# Altium project Arduino Nano.PrjPcb
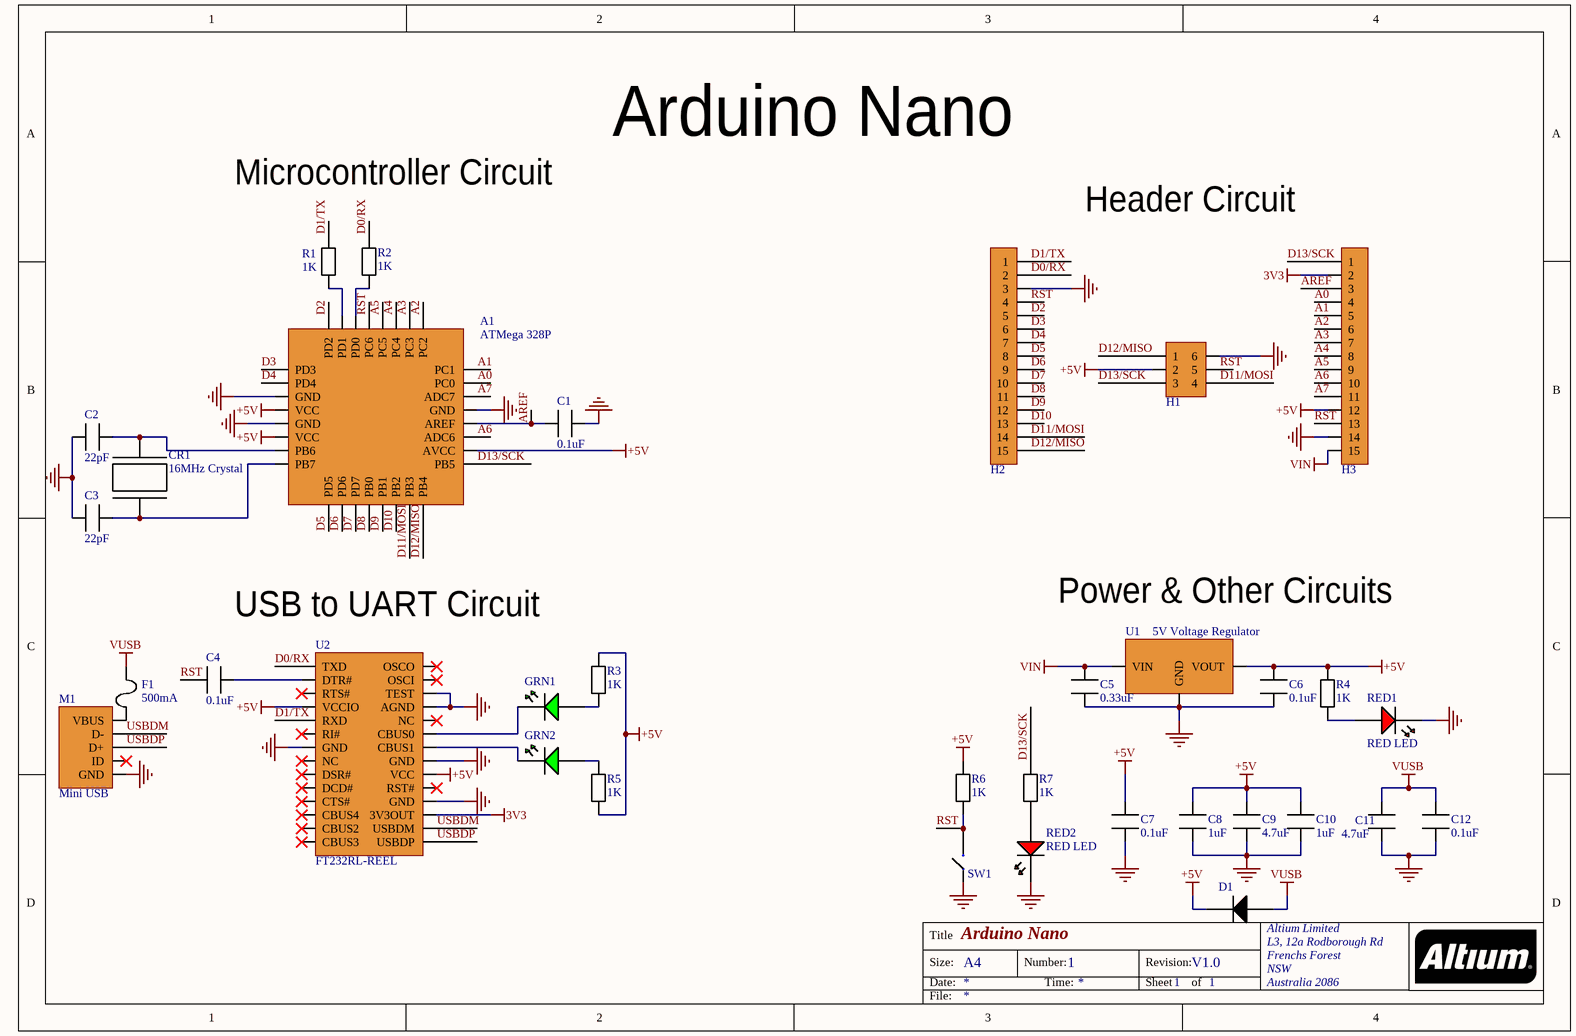
[diagram p0: Schematic.SchDoc]
1 sheet, 34 parts. Net scope: global (net labels, ports and power ports of the same name join across sheets).
Board file: PCB.PcbDoc

## Sheet Schematic.SchDoc: Arduino Nano
size A4; Organization: Altium Limited; Address1: L3, 12a Rodborough Rd; Address2: Frenchs Forest; Address3: NSW; Address4: Australia 2086; DocumentNumber: 1; Revision: V1.0; SheetNumber: 1; SheetTotal: 1

### Parts
A1  ATMega 328P  [ATmega 328P]
C1  0.1uF  [0.1uF Capacitor]
C2  22pF  [22pF]
C3  22pF  [22pF]
C4  0.1uF  [0.1uF Capacitor]
C5  0.33uF  [0.33uF Capacitor]
C6  0.1uF  [0.1uF Capacitor]
C7  0.1uF  [0.1uF Capacitor]
C8  1uF  [1uF Capacitor]
C9  4.7uF  [4.7uF Capacitor]
C10  1uF  [1uF Capacitor]
C11  4.7uF  [4.7uF Capacitor]
C12  0.1uF  [0.1uF Capacitor]
CR1  16MHz Crystal  [16MHz Crystal]
D1  Diode  [Diode]  (value not drawn)
F1  500mA  [Fuse]
GRN1  GREEN LED  [GREEN LED]  (value not drawn)
GRN2  GREEN LED  [GREEN LED]  (value not drawn)
H1  3x3  [3x3 Header]  (value not drawn)
H2  15x1  [15x1 Header]  (value not drawn)
H3  15x1  [15x1 Header]  (value not drawn)
M1  Mini USB  [Mini USB]
R1  1K  [1K Resistor]
R2  1K  [1K Resistor]
R3  1K  [1K Resistor]
R4  1K  [1K Resistor]
R5  1K  [1K Resistor]
R6  1K  [1K Resistor]
R7  1K  [1K Resistor]
RED1  RED LED  [RED LED]
RED2  RED LED  [RED LED]
SW1  Push Button  [Push Button]  (value not drawn)
U1  5V Voltage Regulator  [Voltage Regulator]
U2  FT232RL-REEL  [FTDI]

### Nets
3V3: H3.2 U2.17(3V3OUT)
+5V: A1.4(VCC) A1.6(VCC) A1.18(AVCC) C6.2 C7.1 C8.2 C9.2 C10.2 D1.1 H1.2 H3.12 R3.2 R4.2 R5.1 R6.2 U1.3(VOUT) U2.4(VCCIO) U2.20(VCC)
GND: A1.3(GND) A1.5(GND) A1.21(GND) C1.2 C2.1 C3.2 C5.1 C6.1 C7.2 C8.1 C9.1 C10.1 C11.1 C12.1 H1.6 H2.3 H3.14 M1.5(GND) RED1.1 RED2.1 SW1.1 U1.2(GND) U2.7(GND) U2.18(GND) U2.21(GND) U2.25(AGND) U2.26(TEST)
VIN: C5.2 H3.15 U1.1(VIN)
VUSB: C11.2 C12.2 D1.2 F1.2
A0: A1.23(PC0) H3.4
A1: A1.24(PC1) H3.5
A2: A1.25(PC2) H3.6
A3: A1.26(PC3) H3.7
A4: A1.27(PC4) H3.8
A5: A1.28(PC5) H3.9
A6: A1.19(ADC6) H3.10
A7: A1.22(ADC7) H3.11
AREF: A1.20(AREF) C1.1 H3.3
D0/RX: H2.2 R2.1 U2.1(TXD)
D1/TX: H2.1 R1.2 U2.5(RXD)
D2: A1.32(PD2) H2.5
D3: A1.1(PD3) H2.6
D4: A1.2(PD4) H2.7
D5: A1.9(PD5) H2.8
D6: A1.10(PD6) H2.9
D7: A1.11(PD7) H2.10
D8: A1.12(PB0) H2.11
D9: A1.13(PB1) H2.12
D10: A1.14(PB2) H2.13
D11/MOSI: A1.15(PB3) H1.4 H2.14
D12/MISO: A1.16(PB4) H1.1 H2.15
D13/SCK: A1.17(PB5) H1.3 H3.1 R7.2
RST: A1.29(PC6) C4.1 H1.5 H2.4 H3.13 R6.1 SW1.2
USBDM: M1.2(D-) U2.16(USBDM)
USBDP: M1.3(D+) U2.15(USBDP)
NetA1_7: A1.7(PB6) C2.2 CR1.1
NetA1_8: A1.8(PB7) C3.1 CR1.2
NetA1_30: A1.30(PD0) R2.2
NetA1_31: A1.31(PD1) R1.1
NetC4_2: C4.2 U2.2(DTR#)
NetF1_1: F1.1 M1.1(VBUS)
NetGRN1_1: GRN1.1 U2.23(CBUS0)
NetGRN1_2: GRN1.2 R3.1
NetGRN2_1: GRN2.1 U2.22(CBUS1)
NetGRN2_2: GRN2.2 R5.2
NetR4_1: R4.1 RED1.2
NetR7_1: R7.1 RED2.2

Not connected (* = marked no-connect by the designer): M1 4(ID)*; U2 3(RTS#)* 6(RI#)* 8(NC)* 9(DSR#)* 10(DCD#)* 11(CTS#)* 12(CBUS4)* 13(CBUS2)* 14(CBUS3)* 19(RST#)* 24(NC)* 27(OSCI)* 28(OSCO)*

### Notes on the sheet
- Microcontroller Circuit
- (near H3) Header Circuit
- USB to UART Circuit
- Power & Other Circuits
- Title
- Size:
- Date:
- A4
- Number:
- Time:
- Revision:
- Sheet
- of
- File:

### Library data of the parts
A1 = ATMEGA328P-AUR: ATMEL         ATMEGA328P-AUR             8 Bit Microcontroller, Low Power High Performance, ATmega, 20 MHz, 32 KB, 2 KB, 32 Pins, TQFP; Manufacturer: Microchip / Atmel; Min Supply Voltage: 1.8V; Max Supply Voltage: 5.5V; Frequency: 20MHz; Interface: I2C,SPI,UART,USART; RAM Size: 2KB; Number of I/Os: 23; Number of Timers/Counters: 3; Oscillator Type: Internal; Data Bus Width: 8b; Watchdog Timer: Yes; Memory Type: FLASH; Memory Size: 32KB; Peripherals: Brown-out Detect/Reset,POR,PWM,WDT; Core Architecture: AVR; Supplier 1: Digi-Key; Manufacturer Part Number: ATMEGA328P-AUR; RoHS: Yes; Category: Microcontrollers; Stock 1: 15541; Pricing 1: 1=2.08000, 25=1.91000, 100=1.73000 (USD); Mount: Surface Mount; Case/Package: A; Number of Pins: 32; Contact Plating: Tin,Matte; Min Operating Temperature: -40°C; Max Operating Temperature: 85°C; Packaging: Tape and Reel; Package Quantity: 2000; Number of Programmable I/O: 23; Max Frequency: 20MHz; REACH SVHC: No SVHC; Lead Free: Lead Free; ComponentLink1URL: https://datasheet.ciiva.com/6641/atmega48a-pa-88a-pa-168a-pa-328-p-ds-ds40002061a-6641009.pdf?src-supplier=Digi-Key; ComponentLink1Description: https://datasheet.ciiva.com/6641/atmega48a-pa-88a-pa-168a-pa-328-p-ds-ds40002061a-6641009.pdf?src-supplier=Digi-Key; Supplier Part Number 1: ATMEGA328P-AURCT-ND
C1 C4 C6 C7 C12 = EMK105BJ104KV-F: TAIYO YUDEN - EMK105BJ104KV-F - CERAMIC CAPACITOR, 0.1UF, 16V, X5R, 10%, 0402, FULL REEL; Capacitance: 100nF; Supplier 1: Digi-Key; Manufacturer: Taiyo Yuden; Manufacturer Part Number: EMK105BJ104KV-F; RoHS: Yes; Category: Ceramic Capacitors; Stock 1: 2015960; Pricing 1: 1=0.10000, 10=0.02100, 50=0.01120, 100=0.00920, 500=0.00654, 1000=0.00514, 2500=0.00468, 5000=0.00430 (USD); Mount: Surface Mount; Case/Package: 0402; Number of Pins: 2; Contact Plating: Tin; Case Code (Metric): 1005; Case Code (Imperial): 0402; Min Operating Temperature: -55°C; Max Operating Temperature: 85°C; Dielectric: X5R; Tolerance: 10%; Packaging: Tape and Reel; Voltage Rating (DC): 16V; Termination: SMD/SMT; Resistor Type: Ceramic; Voltage Rating: 16V; Package Quantity: 1; Length: 1mm; Width: 0.02inch; Height: 0.5mm; Thickness: 0.022inch; Depth: 0.5mm; Radiation Hardening: No; Lead Free: Lead Free; Halogen Free: Halogen Free; REACH SVHC: Unknown; ComponentLink1URL: https://datasheet.ciiva.com/30156/744emk105bj104kv-f-30156673.pdf?src-supplier=Onlinecomponents.com; ComponentLink1Description: https://datasheet.ciiva.com/30156/744emk105bj104kv-f-30156673.pdf?src-supplier=Onlinecomponents.com; ComponentLink2URL: https://datasheet.ciiva.com/30119/255emk105bj104kv-f-30119734.pdf?src-supplier=Onlinecomponents.com; ComponentLink2Description: https://datasheet.ciiva.com/30119/255emk105bj104kv-f-30119734.pdf?src-supplier=Onlinecomponents.com; ComponentLink3URL: https://datasheet.ciiva.com/129/emk105bj104kv-f-ss-129786.pdf?src-supplier=Digi-Key; ComponentLink3Description: https://datasheet.ciiva.com/129/emk105bj104kv-f-ss-129786.pdf?src-supplier=Digi-Key; ComponentLink4URL: https://datasheet.ciiva.com/15920/1135emk105bj104kv-f-15920444.pdf?src-supplier=Onlinecomponents.com; ComponentLink4Description: https://datasheet.ciiva.com/15920/1135emk105bj104kv-f-15920444.pdf?src-supplier=Onlinecomponents.com; ComponentLink5URL: https://datasheet.ciiva.com/5443/mlcc-all-e-541559-5443819.pdf?src-supplier=Mouser; ComponentLink5Description: https://datasheet.ciiva.com/5443/mlcc-all-e-541559-5443819.pdf?src-supplier=Mouser; Supplier Part Number 1: 587-1226-1-ND
C2 C3 = 04025A220FAT2A: Cap Ceramic 22pF 50V C0G 1% SMD 0402 125C Paper T/R; Manufacturer: Kyocera AVX; Supplier 1: Digi-Key; Manufacturer Part Number: 04025A220FAT2A; RoHS: Yes; Category: Ceramic Capacitors; Stock 1: 43003; Pricing 1: 1=0.51000, 10=0.36100, 50=0.27280, 100=0.23760, 500=0.17600, 1000=0.14960, 2500=0.14080, 5000=0.13200 (USD); Mount: Surface Mount; Case/Package: 0402; Case Code (Metric): 1005; Case Code (Imperial): 0402; Contact Plating: Tin,Matte; Min Operating Temperature: -55°C; Max Operating Temperature: 125°C; Capacitance: 22pF; Tolerance: 1%; Voltage Rating: 50V; Packaging: Tape and Reel; Package Quantity: 1; Voltage Rating (DC): 50V; Dielectric: C0G; Termination: SMD/SMT; Length: 1mm; Width: 0.02inch; Height: 0.56mm; Thickness: 0.022inch; Depth: 0.5mm; Radiation Hardening: No; REACH SVHC: Unknown; Lead Free: Lead Free; ComponentLink1URL: https://datasheet.ciiva.com/153/ccog-153298.pdf?src-supplier=Digi-Key; ComponentLink1Description: https://datasheet.ciiva.com/153/ccog-153298.pdf?src-supplier=Digi-Key; ComponentLink2URL: https://datasheet.ciiva.com/153/ccog-153299.pdf?src-supplier=Digi-Key; ComponentLink2Description: https://datasheet.ciiva.com/153/ccog-153299.pdf?src-supplier=Digi-Key; ComponentLink3URL: https://datasheet.ciiva.com/153/ccog-153300.pdf?src-supplier=Digi-Key; ComponentLink3Description: https://datasheet.ciiva.com/153/ccog-153300.pdf?src-supplier=Digi-Key; ComponentLink4URL: https://datasheet.ciiva.com/11530/ccog-11530021.pdf?src-supplier=Avnet; ComponentLink4Description: https://datasheet.ciiva.com/11530/ccog-11530021.pdf?src-supplier=Avnet; ComponentLink5URL: https://datasheet.ciiva.com/5419/ccog-243403-5419529.pdf?src-supplier=Mouser; ComponentLink5Description: https://datasheet.ciiva.com/5419/ccog-243403-5419529.pdf?src-supplier=Mouser; Supplier Part Number 1: 478-5765-1-ND
C5 = CGA2B1X7S1C334K050BC: Automotive Grade; Manufacturer: TDK; Capacitance: 330nF; Voltage Rating: 16V; Tolerance: 10%; Dielectric: X7S; Supplier 1: Digi-Key; Manufacturer Part Number: CGA2B1X7S1C334K050BC; RoHS: Yes; Category: Ceramic Capacitors; Stock 1: 26015; Pricing 1: 1=0.23000, 10=0.15800, 50=0.09460, 100=0.07980, 500=0.05460, 1000=0.04830, 2500=0.04620, 5000=0.04200 (USD); Mount: Surface Mount; Case/Package: 0402; Case Code (Imperial): 0402; Case Code (Metric): 1005; Weight: 2.3E-05oz; Min Operating Temperature: -55°C; Max Operating Temperature: 125°C; Packaging: Tape and Reel; Termination: SMD/SMT; Voltage Rating (DC): 16V; Package Quantity: 10000; Length: 0.039inch; Width: 0.02inch; Height: 0.5mm; Thickness: 0.022inch; Ratings: AEC-Q200; ComponentLink1URL: https://product.tdk.com/info/en/catalog/datasheets/mlcc_automotive_general_en.pdf?src-supplier=Digi-Key; ComponentLink1Description: https://product.tdk.com/info/en/catalog/datasheets/mlcc_automotive_general_en.pdf?src-supplier=Digi-Key; ComponentLink2URL: https://product.tdk.com/info/en/catalog/spec/mlccspec_automotive_general_midvoltage_en.pdf?src-supplier=Digi-Key; ComponentLink2Description: https://product.tdk.com/info/en/catalog/spec/mlccspec_automotive_general_midvoltage_en.pdf?src-supplier=Digi-Key; ComponentLink3URL: http://product.tdk.com/capacitor/mlcc/class/print_detail_pdf.php?lang=en&part_no=CGA2B1X7S1C334K050BC&src-supplier=Avnet; ComponentLink3Description: http://product.tdk.com/capacitor/mlcc/class/print_detail_pdf.php?lang=en&part_no=CGA2B1X7S1C334K050BC&src-supplier=Avnet; ComponentLink4URL: http://product.tdk.com/capacitor/mlcc/detailed_information.php?lang=en&ref=jp&part_no=CGA2B1X7S1C334K050BC&src-supplier=Mouser; ComponentLink4Description: http://product.tdk.com/capacitor/mlcc/detailed_information.php?lang=en&ref=jp&part_no=CGA2B1X7S1C334K050BC&src-supplier=Mouser; Supplier Part Number 1: 445-180203-1-ND
C8 C10 = LMK105BJ105KV-F: Manufacturer: Taiyo Yuden; Tolerance: 10%; Voltage Rating (DC): 10V; Dielectric: X5R; Supplier 1: Digi-Key; Manufacturer Part Number: LMK105BJ105KV-F; RoHS: Yes; Category: Ceramic Capacitors; Stock 1: 3118229; Pricing 1: 1=0.11000, 10=0.07900, 50=0.04300, 100=0.03500, 500=0.02502, 1000=0.01966, 2500=0.01788, 5000=0.01645 (USD); Mount: Surface Mount; Case/Package: 0402; Case Code (Imperial): 0402; Case Code (Metric): 1005; Min Operating Temperature: -55°C; Max Operating Temperature: 85°C; Capacitance: 1uF; Packaging: Tape and Reel; Package Quantity: 1; Voltage Rating: 10V; Termination: SMD/SMT; Resistor Type: Ceramic; Length: 1mm; Width: 0.5mm; Height: 0.5mm; Thickness: 0.022inch; Depth: 0.5mm; Radiation Hardening: No; Lead Free: Lead Free; Halogen Free: Halogen Free; REACH SVHC: Unknown; ComponentLink1URL: https://datasheet.ciiva.com/26872/getdatasheetpartid-637441-26872608.pdf?src-supplier=Verical; ComponentLink1Description: https://datasheet.ciiva.com/26872/getdatasheetpartid-637441-26872608.pdf?src-supplier=Verical; ComponentLink2URL: https://datasheet.ciiva.com/15921/463lmk105bj105kv-f-15921218.pdf?src-supplier=Onlinecomponents.com; ComponentLink2Description: https://datasheet.ciiva.com/15921/463lmk105bj105kv-f-15921218.pdf?src-supplier=Onlinecomponents.com; ComponentLink3URL: https://datasheet.ciiva.com/131/lmk105bj105kv-f-ss-131735.pdf?src-supplier=Digi-Key; ComponentLink3Description: https://datasheet.ciiva.com/131/lmk105bj105kv-f-ss-131735.pdf?src-supplier=Digi-Key; ComponentLink4URL: https://datasheet.ciiva.com/30256/308lmk105bj105kv-f-30256903.pdf?src-supplier=Onlinecomponents.com; ComponentLink4Description: https://datasheet.ciiva.com/30256/308lmk105bj105kv-f-30256903.pdf?src-supplier=Onlinecomponents.com; Supplier Part Number 1: 587-1454-1-ND
C9 C11 = JMK105BBJ475MVHF: CAP CER 4.7UF 6.3V X5R 0402; Manufacturer: Taiyo Yuden; Tolerance: 20%; Supplier 1: Digi-Key; Manufacturer Part Number: JMK105BBJ475MVHF; RoHS: Yes; Category: Ceramic Capacitors; Stock 1: 77436; Pricing 1: 1=0.18000, 10=0.12700, 50=0.07220, 100=0.05980, 500=0.04194, 1000=0.03472, 2500=0.03231, 5000=0.02956 (USD); Mount: Surface Mount; Case/Package: 0402; Weight: 2.3E-05oz; Case Code (Metric): 1005; Contact Plating: Tin; Case Code (Imperial): 0402; Min Operating Temperature: -55°C; Max Operating Temperature: 85°C; Dielectric: X5R; Termination: SMD/SMT; Voltage Rating (DC): 6.3V; Packaging: Tape and Reel; Voltage Rating: 6.3V; Capacitance: 4.7uF; Package Quantity: 10000; Length: 1mm; Width: 0.5mm; Height: 0.5mm; Thickness: 0.026inch; Ratings: AEC-Q200; Lead Free: Lead Free; Halogen Free: Halogen Free; ComponentLink1URL: http://www.farnell.com/datasheets/2819875.pdf?src-supplier=Farnell; ComponentLink1Description: http://www.farnell.com/datasheets/2819875.pdf?src-supplier=Farnell; ComponentLink2URL: http://www.mouser.com/ds/2/396/mlcc11_hq_e-541564.pdf?src-supplier=Mouser; ComponentLink2Description: http://www.mouser.com/ds/2/396/mlcc11_hq_e-541564.pdf?src-supplier=Mouser; ComponentLink3URL: http://www.yuden.co.jp/ut/product/category/capacitor/putpdf/JMK105BBJ475MVHF_SS.pdf?src-supplier=Avnet; ComponentLink3Description: http://www.yuden.co.jp/ut/product/category/capacitor/putpdf/JMK105BBJ475MVHF_SS.pdf?src-supplier=Avnet; ComponentLink4URL: http://www.farnell.com/datasheets/2819875.pdf?src-supplier=Newark; ComponentLink4Description: http://www.farnell.com/datasheets/2819875.pdf?src-supplier=Newark; ComponentLink5URL: http://www.farnell.com/datasheets/2819875.pdf?src-supplier=Element14; ComponentLink5Description: http://www.farnell.com/datasheets/2819875.pdf?src-supplier=Element14; ComponentLink6URL: http://www.yuden.co.jp/productdata/catalog/en/mlcc_all_e.pdf?src-supplier=Avnet+Asia; ComponentLink6Description: http://www.yuden.co.jp/productdata/catalog/en/mlcc_all_e.pdf?src-supplier=Avnet+Asia; ComponentLink7URL: http://www.yuden.co.jp/productdata/catalog/en/mlcc_all_hq_e.pdf?src-supplier=Digi-Key; ComponentLink7Description: http://www.yuden.co.jp/productdata/catalog/en/mlcc_all_hq_e.pdf?src-supplier=Digi-Key; ComponentLink8URL: http://ds.yuden.co.jp/TYCOMPAS/ut/detail.do?productNo=JMK105BBJ475MVHF&fileName=JMK105BBJ475MVHF_SS&mode=specSheetDownload&src-supplier=Digi-Key; ComponentLink8Description: http://ds.yuden.co.jp/TYCOMPAS/ut/detail.do?productNo=JMK105BBJ475MVHF&fileName=JMK105BBJ475MVHF_SS&mode=specSheetDownload&src-supplier=Digi-Key; Supplier Part Number 1: 587-3711-1-ND
CR1 = ECS-160-20-5PX-TR: CRYSTAL 16.0000MHZ 20PF SMD; Manufacturer: ECS International; Frequency Tolerance: 30ppm; ESR (Equivalent Series Resistance): 40R; Frequency Stability: 50ppm; Supplier 1: Digi-Key; Manufacturer Part Number: ECS-160-20-5PX-TR; RoHS: Yes; Category: Crystals; Stock 1: 15488; Pricing 1: 1=0.45000, 10=0.37500, 50=0.33760, 100=0.30000, 500=0.28500 (USD); Mount: Surface Mount; Number of Pins: 2; Min Operating Temperature: -10°C; Max Operating Temperature: 70°C; Package Quantity: 1000; Frequency: 16MHz; Load Capacitance: 20pF; Packaging: Tape and Reel; Tolerance: 30ppm; Termination: SMD/SMT; Length: 0.449inch; Width: 0.189inch; Height: 0.169inch; Lead Free: Lead Free; ComponentLink1URL: https://datasheet.ciiva.com/852/csm-7x-852386.pdf?src-supplier=Digi-Key; ComponentLink1Description: https://datasheet.ciiva.com/852/csm-7x-852386.pdf?src-supplier=Digi-Key; ComponentLink2URL: https://datasheet.ciiva.com/852/csm-7x-852388.pdf?src-supplier=Digi-Key; ComponentLink2Description: https://datasheet.ciiva.com/852/csm-7x-852388.pdf?src-supplier=Digi-Key; ComponentLink3URL: https://datasheet.ciiva.com/852/csm-7x-852387.pdf?src-supplier=Digi-Key; ComponentLink3Description: https://datasheet.ciiva.com/852/csm-7x-852387.pdf?src-supplier=Digi-Key; Supplier Part Number 1: XC1282CT-ND
D1 = BAT54LP-7: MULTICOMP PRO - BAT54LP-7 - DIODE, ULTRAFAST RECOVERY, 100mA, 30V, DFN1006; Manufacturer: Diodes; Forward Voltage: 1V; Forward Current: 200mA; Max Reverse Current: 2uA; Reverse Recovery Time: 5ns; Power Dissipation: 250mW; Max Forward Surge Current (Ifsm): 600mA; Element Configuration: Single; Polarity: Standard; Capacitance: 10pF; Supplier 1: Digi-Key; Manufacturer Part Number: BAT54LP-7; RoHS: Yes; Category: Schottky Diodes; Stock 1: 105889; Pricing 1: 1=0.40000, 10=0.28200, 100=0.14250, 500=0.11626, 1000=0.08625 (USD); Mount: Surface Mount; Case/Package: DFN; Number of Pins: 2; Contact Plating: Gold; Min Operating Temperature: -65°C; Max Operating Temperature: 125°C; Packaging: Tape and Reel; Package Quantity: 3000; Average Rectified Current: 200mA; Max Repetitive Reverse Voltage (Vrrm): 30V; Peak Non-Repetitive Surge Current: 600mA; Voltage Rating (DC): 30V; Power Rating: 250mW; Current Rating: 200mA; Output Current: 200mA; Max Reverse Voltage (DC): 30V; Length: 1mm; Width: 0.6mm; Height: 0.47mm; Radiation Hardening: No; REACH SVHC: No SVHC; Lead Free: Lead Free; ComponentLink1URL: https://datasheet.ciiva.com/16210/ds30504-16210561.pdf?src-supplier=Future+Electronics; ComponentLink1Description: https://datasheet.ciiva.com/16210/ds30504-16210561.pdf?src-supplier=Future+Electronics; ComponentLink2URL: https://datasheet.ciiva.com/4715/ds30504-85267-4715512.pdf?src-supplier=Mouser; ComponentLink2Description: https://datasheet.ciiva.com/4715/ds30504-85267-4715512.pdf?src-supplier=Mouser; ComponentLink3URL: https://datasheet.ciiva.com/15144/getdatasheetpartid-39647-15144085.pdf?src-supplier=Verical; ComponentLink3Description: https://datasheet.ciiva.com/15144/getdatasheetpartid-39647-15144085.pdf?src-supplier=Verical; ComponentLink4URL: https://datasheet.ciiva.com/8303/ds30504-8303286.pdf?src-supplier=Avnet; ComponentLink4Description: https://datasheet.ciiva.com/8303/ds30504-8303286.pdf?src-supplier=Avnet; ComponentLink5URL: https://datasheet.ciiva.com/8300/ds30504-8300695.pdf?src-supplier=Avnet; ComponentLink5Description: https://datasheet.ciiva.com/8300/ds30504-8300695.pdf?src-supplier=Avnet; ComponentLink6URL: https://datasheet.ciiva.com/22695/1915672-22695255.pdf?src-supplier=Element14; ComponentLink6Description: https://datasheet.ciiva.com/22695/1915672-22695255.pdf?src-supplier=Element14; ComponentLink7URL: https://datasheet.ciiva.com/913/ds30504-913080.pdf?src-supplier=Digi-Key; ComponentLink7Description: https://datasheet.ciiva.com/913/ds30504-913080.pdf?src-supplier=Digi-Key; ComponentLink8URL: https://datasheet.ciiva.com/913/ds30504-913081.pdf?src-supplier=Digi-Key; ComponentLink8Description: https://datasheet.ciiva.com/913/ds30504-913081.pdf?src-supplier=Digi-Key; ComponentLink9URL: https://datasheet.ciiva.com/913/ds30504-913082.pdf?src-supplier=Digi-Key; ComponentLink9Description: https://datasheet.ciiva.com/913/ds30504-913082.pdf?src-supplier=Digi-Key; ComponentLink10URL: https://datasheet.ciiva.com/1180/ds30504-1180298.pdf?src-supplier=Element14; ComponentLink10Description: https://datasheet.ciiva.com/1180/ds30504-1180298.pdf?src-supplier=Element14; ComponentLink11URL: https://datasheet.ciiva.com/25947/ds30504-25947226.pdf?src-supplier=Avnet+Europe; ComponentLink11Description: https://datasheet.ciiva.com/25947/ds30504-25947226.pdf?src-supplier=Avnet+Europe; Supplier Part Number 1: BAT54LPDICT-ND
F1 = C1Q500: Fuse Chip 0.5A 125V Very Fast 2-Pin Solder Pad Surface Mount T/R; Manufacturer: Bel; Max Voltage Rating (DC): 63V; DC Cold Resistance: 320mR; Power Dissipation: 140mW; Fuse Type: Board Mount (Cartridge Style Excluded); Approvals: CSA,CE,cULus; Supplier 1: Digi-Key; Manufacturer Part Number: C1Q500; RoHS: Yes; Category: Fuses; Stock 1: 93521; Pricing 1: 1=0.28000, 5=0.27600, 10=0.26300, 50=0.23500, 100=0.21870, 250=0.19440, 500=0.16200, 1000=0.15390 (USD); Mount: Surface Mount; Case/Package: 1206; Number of Pins: 2; Case Code (Metric): 3216; Case Code (Imperial): 1206; Housing Material: Ceramic; Min Operating Temperature: -55°C; Max Operating Temperature: 125°C; Current Rating: 500mA; Voltage Rating (AC): 125V; Voltage Rating (DC): 63V; Packaging: Tape and Reel; Length: 3.07mm; Width: 0.062inch; Height: 0.023inch; Depth: 1.52mm; Lead Free: Lead Free; ComponentLink1URL: https://datasheet.ciiva.com/300/c1q-300590.pdf?src-supplier=Digi-Key; ComponentLink1Description: https://datasheet.ciiva.com/300/c1q-300590.pdf?src-supplier=Digi-Key; ComponentLink2URL: https://datasheet.ciiva.com/300/c1q-300592.pdf?src-supplier=Digi-Key; ComponentLink2Description: https://datasheet.ciiva.com/300/c1q-300592.pdf?src-supplier=Digi-Key; ComponentLink3URL: https://datasheet.ciiva.com/300/c1q-300591.pdf?src-supplier=Digi-Key; ComponentLink3Description: https://datasheet.ciiva.com/300/c1q-300591.pdf?src-supplier=Digi-Key; ComponentLink4URL: https://datasheet.ciiva.com/8264/c1q-8264015.pdf?src-supplier=Avnet; ComponentLink4Description: https://datasheet.ciiva.com/8264/c1q-8264015.pdf?src-supplier=Avnet; Supplier Part Number 1: 507-1075-1-ND
GRN1 GRN2 = 150040VS73240: LED GREEN CLEAR 0402 SMD; Manufacturer: Wurth Electronics; Lens Color: Colorless; Lens Style: Flat; Luminous Intensity: 50mcd; Forward Voltage: 2V; Test Current: 20mA; Viewing Angle: 120°; Dominant Wavelength: 570nm; Lens Size: 0.5mm; Supplier 1: Digi-Key; Manufacturer Part Number: 150040VS73240; RoHS: No; Category: LEDs; Stock 1: 46612; Pricing 1: 1=0.30000, 10=0.25400, 100=0.22900, 500=0.20400, 1000=0.17900 (USD); Mount: Surface Mount; Case/Package: 0402; Color: Green; Case Code (Imperial): 0402; Case Code (Metric): 1005; Packaging: Tape and Reel; Lens Transparency: Clear; Length: 1mm; Width: 0.5mm; Height: 0.5mm; ComponentLink1URL: http://www.farnell.com/datasheets/2621637.pdf?src-supplier=Farnell; ComponentLink1Description: http://www.farnell.com/datasheets/2621637.pdf?src-supplier=Farnell; ComponentLink2URL: https://katalog.we-online.de/pbs/datasheet/150040VS73240.pdf?src-supplier=Digi-Key; ComponentLink2Description: https://katalog.we-online.de/pbs/datasheet/150040VS73240.pdf?src-supplier=Digi-Key; ComponentLink3URL: http://www.farnell.com/datasheets/2621637.pdf?src-supplier=Element14; ComponentLink3Description: http://www.farnell.com/datasheets/2621637.pdf?src-supplier=Element14; ComponentLink4URL: http://www.farnell.com/datasheets/2621637.pdf?src-supplier=Newark; ComponentLink4Description: http://www.farnell.com/datasheets/2621637.pdf?src-supplier=Newark; Supplier Part Number 1: 732-11992-1-ND
H1 = 61300621121: CONN HEADER VERT 6POS 2.54MM; Manufacturer: Wurth Electronics; Number of Positions: 6; Gender: Male; Connector Type: Male Pin; Pitch: 0.1inch; Supplier 1: Digi-Key; Manufacturer Part Number: 61300621121; RoHS: Yes; Category: Connectors; Stock 1: 5661; Pricing 1: 1=0.54000, 10=0.45400, 25=0.37920, 50=0.31600, 100=0.28700, 1000=0.26100 (USD); Mount: Through Hole; Contact Plating: Gold; Contact Material: Copper; Color: Black; Number of Rows: 2; Packaging: Bulk; Termination: Solder; Number of Contacts: 6; Row Spacing: 0.1inch; Contact Mating Length: 0.236inch; REACH SVHC: Unknown; ComponentLink1URL: https://datasheet.ciiva.com/28505/1442180-28505463.pdf?src-supplier=Element14; ComponentLink1Description: https://datasheet.ciiva.com/28505/1442180-28505463.pdf?src-supplier=Element14; Supplier Part Number 1: 732-5295-ND
H2 H3 = 61301511121: WURTH ELEKTRONIK         61301511121            Board-To-Board Connector, Vertical, WR-PHD Series, Through Hole, Header, 15 Contacts, 2.54 mm; Manufacturer: Wurth Electronics; Number of Positions: 15; Gender: Male; Connector Type: Male Pin; Pitch: 0.1inch; Supplier 1: Digi-Key; Manufacturer Part Number: 61301511121; RoHS: Yes; Category: Connectors; Stock 1: 461; Pricing 1: 1=0.82000, 10=0.69700, 25=0.58120, 50=0.48400, 100=0.44000, 500=0.40000 (USD); Mount: Through Hole; Color: Black; Contact Plating: Gold; Contact Material: Copper; Packaging: Bulk; Termination: Solder; Number of Contacts: 15; Number of Rows: 1; Contact Mating Length: 0.236inch; REACH SVHC: Unknown; ComponentLink1URL: https://katalog.we-online.de/em/datasheet/6130xx11121.pdf?src-supplier=Digi-Key; ComponentLink1Description: https://katalog.we-online.de/em/datasheet/6130xx11121.pdf?src-supplier=Digi-Key; ComponentLink2URL: http://www.farnell.com/cad/1737268.pdf?src-supplier=Element14; ComponentLink2Description: http://www.farnell.com/cad/1737268.pdf?src-supplier=Element14; Supplier Part Number 1: 732-5326-ND
M1 = 65100516121: CONN RCPT USB2.0 MINI B SMD R/A; Manufacturer: Wurth Electronics; Gender: Receptacle; Contact Resistance: 20mR; Current Rating: 1A; Mating Cycles: 1500; Voltage Rating: 30V; Connector Type: USB,Socket; Number of Contacts: 5; Number of Ports: 1; Insulation Resistance: 1GR; Supplier 1: Digi-Key; Manufacturer Part Number: 65100516121; RoHS: Yes; Category: Connectors; Stock 1: 2378; Pricing 1: 1=1.32000, 10=1.16500, 50=1.09800, 100=0.98600, 250=0.89600 (USD); Mount: Surface Mount,Horizontal; Color: Black; Contact Plating: Gold; Contact Material: Copper Alloy; Min Operating Temperature: -40°C; Max Operating Temperature: 105°C; Package Quantity: 500; Packaging: Tape and Reel; Number of Positions: 5; Termination: Solder; Working Voltage: 30V; Orientation: Right Angle; USB Standard: USB 2.0; Length: 7.7mm; Width: 9.25mm; REACH SVHC: Unknown; Lead Free: Lead Free; Flammability Rating: UL94 V-0; ComponentLink1URL: https://datasheet.ciiva.com/29660/65100516121-29660272.pdf?src-supplier=Digi-Key; ComponentLink1Description: https://datasheet.ciiva.com/29660/65100516121-29660272.pdf?src-supplier=Digi-Key; ComponentLink2URL: https://datasheet.ciiva.com/22694/1442207-22694625.pdf?src-supplier=Element14; ComponentLink2Description: https://datasheet.ciiva.com/22694/1442207-22694625.pdf?src-supplier=Element14; ComponentLink3URL: https://datasheet.ciiva.com/4598/65100516121-83749-4598775.pdf?src-supplier=Mouser; ComponentLink3Description: https://datasheet.ciiva.com/4598/65100516121-83749-4598775.pdf?src-supplier=Mouser; ComponentLink4URL: https://datasheet.ciiva.com/851/65100516121-851772.pdf?src-supplier=Digi-Key; ComponentLink4Description: https://datasheet.ciiva.com/851/65100516121-851772.pdf?src-supplier=Digi-Key; ComponentLink5URL: https://datasheet.ciiva.com/11731/0900766b81023aba-11731279.pdf?src-supplier=RSComponents; ComponentLink5Description: https://datasheet.ciiva.com/11731/0900766b81023aba-11731279.pdf?src-supplier=RSComponents; ComponentLink6URL: https://datasheet.ciiva.com/1098/1442207-1098982.pdf?src-supplier=Element14; ComponentLink6Description: https://datasheet.ciiva.com/1098/1442207-1098982.pdf?src-supplier=Element14; ComponentLink7URL: https://datasheet.ciiva.com/22652/1442207-22652217.pdf?src-supplier=Farnell; ComponentLink7Description: https://datasheet.ciiva.com/22652/1442207-22652217.pdf?src-supplier=Farnell; ComponentLink8URL: https://datasheet.ciiva.com/14103/4257103-eng-datasheet-14103419.pdf?src-supplier=Distrelec; ComponentLink8Description: https://datasheet.ciiva.com/14103/4257103-eng-datasheet-14103419.pdf?src-supplier=Distrelec; ComponentLink9URL: https://datasheet.ciiva.com/48712/001088422-da-01-en-wr-com-mini-mini-usb-typ-b-65100516121-48712668.pdf?src-supplier=Conrad; ComponentLink9Description: https://datasheet.ciiva.com/48712/001088422-da-01-en-wr-com-mini-mini-usb-typ-b-65100516121-48712668.pdf?src-supplier=Conrad; Supplier Part Number 1: 732-2109-1-ND
R1-R7 = RMCF0402FT1K00: RES 1K OHM 1% 1/16W 0402; Manufacturer: Stackpole Electronics; Max Power Dissipation: 63mW; Temperature Coefficient: 100ppm/°C; Resistance: 1kR; Supplier 1: Digi-Key; Manufacturer Part Number: RMCF0402FT1K00; RoHS: Yes; Category: Chip SMD Resistors; Stock 1: 290118; Pricing 1: 1=0.10000, 10=0.01300, 100=0.00530, 1000=0.00239, 2500=0.00207, 5000=0.00171 (USD); Mount: Surface Mount; Case/Package: 0402; Case Code (Metric): 1005; Case Code (Imperial): 0402; Contact Plating: Tin,Matte; Min Operating Temperature: -55°C; Max Operating Temperature: 155°C; Tolerance: 1%; Features: Automotive AEC-Q200; Resistor Type: Thick Film; Number of Terminations: 2; Packaging: Tape and Reel; Power Rating: 63mW; Length: 1mm; Width: 0.02inch; Height: 0.016inch; Depth: 0.5mm; Radiation Hardening: No; Military Standard: Not; Lead Free: Lead Free; ComponentLink1URL: https://datasheet.ciiva.com/15193/getdatasheetpartid-365385-15193418.pdf?src-supplier=Verical; ComponentLink1Description: https://datasheet.ciiva.com/15193/getdatasheetpartid-365385-15193418.pdf?src-supplier=Verical; ComponentLink2URL: https://datasheet.ciiva.com/24336/sei-rmcp-24336266.pdf?src-supplier=Onlinecomponents.com; ComponentLink2Description: https://datasheet.ciiva.com/24336/sei-rmcp-24336266.pdf?src-supplier=Onlinecomponents.com; Supplier Part Number 1: RMCF0402FT1K00CT-ND
RED1 RED2 = 150040RS73240: LED RED CLEAR 0402 SMD; Manufacturer: Wurth Electronics; Lens Color: Colorless; Lens Style: Flat; Luminous Intensity: 100mcd; Forward Voltage: 2V; Test Current: 20mA; Viewing Angle: 120°; Dominant Wavelength: 625nm; Lens Size: 0.5mm; Supplier 1: Digi-Key; Manufacturer Part Number: 150040RS73240; RoHS: No; Category: LEDs; Stock 1: 7760; Pricing 1: 1=0.30000, 10=0.25400, 100=0.22900, 500=0.20400, 1000=0.17900 (USD); Mount: Surface Mount; Case/Package: 0402; Color: Red; Case Code (Imperial): 0402; Case Code (Metric): 1005; Packaging: Tape and Reel; Lens Transparency: Clear; Length: 1mm; Width: 0.5mm; Height: 0.5mm; ComponentLink1URL: http://www.farnell.com/datasheets/2621636.pdf?src-supplier=Farnell; ComponentLink1Description: http://www.farnell.com/datasheets/2621636.pdf?src-supplier=Farnell; ComponentLink2URL: https://katalog.we-online.de/pbs/datasheet/150040RS73240.pdf?src-supplier=Digi-Key; ComponentLink2Description: https://katalog.we-online.de/pbs/datasheet/150040RS73240.pdf?src-supplier=Digi-Key; ComponentLink3URL: http://www.farnell.com/datasheets/2621636.pdf?src-supplier=Element14; ComponentLink3Description: http://www.farnell.com/datasheets/2621636.pdf?src-supplier=Element14; ComponentLink4URL: http://www.farnell.com/datasheets/2621636.pdf?src-supplier=Newark; ComponentLink4Description: http://www.farnell.com/datasheets/2621636.pdf?src-supplier=Newark; Supplier Part Number 1: 732-11991-1-ND
SW1 = 434121043836: SWITCH TACTILE SPST-NO 0.05A 12V; Manufacturer: Wurth Electronics; Mechanical Life: 50000Cycles; Actuator Material: Polymer,Liquid Crystal Polymer; Illumination Type: Non-Illuminated; Operating Force: 360gf; Throw Configuration: SPST; Switch Travel: 0.25mm; Switch Function: Off-Mom; Supplier 1: Digi-Key; Manufacturer Part Number: 434121043836; RoHS: Yes; Category: Tactile Switches; Stock 1: 4117; Pricing 1: 1=0.39000, 900=0.31320 (USD); Termination: SMD/SMT; ComponentLink1URL: http://katalog.we-online.de/em/datasheet/434121043836.pdf?src-supplier=Digi-Key; ComponentLink1Description: http://katalog.we-online.de/em/datasheet/434121043836.pdf?src-supplier=Digi-Key; ComponentLink2URL: https://katalog.we-online.de/em/datasheet/434121043836.pdf?src-supplier=Digi-Key; ComponentLink2Description: https://katalog.we-online.de/em/datasheet/434121043836.pdf?src-supplier=Digi-Key; Supplier Part Number 1: 732-7047-1-ND
U1 = UA78L05ACPK: TEXAS INSTRUMENTS - UA78L05ACPK - LINEAR VOLT REG, 5V, 0.1A, SOT-89-3; Output Type: Fixed; Quiescent Current: 3.8mA; Output Current: 100mA; Number of Outputs: 1; Dropout Voltage: 1.7V; Min Input Voltage: 7V; Max Input Voltage: 20V; Power Supply Rejection Ratio (PSRR): 49dB; Polarity: Positive; Output Voltage Accuracy: 5%; Supplier 1: Digi-Key; Manufacturer: Texas Instruments; Manufacturer Part Number: UA78L05ACPK; RoHS: Yes; Category: Voltage Regulators - Linear; Stock 1: 54244; Pricing 1: 1=0.41000, 10=0.32900, 25=0.30120, 100=0.20300, 250=0.16800, 500=0.15400 (USD); Mount: Surface Mount; Case/Package: SOT-89; Number of Pins: 3; Weight: 0.004603oz; Contact Plating: Tin,Matte; Min Operating Temperature: -40°C; Max Operating Temperature: 125°C; Nominal Output Voltage: 5V; Packaging: Tape and Reel; Output Voltage: 5V; Package Quantity: 1; Max Output Current: 100mA; Number of Regulators: 1; Accuracy: 5%; Radiation Hardening: No; REACH SVHC: No SVHC; Lead Free: Lead Free; ComponentLink1URL: https://datasheet.ciiva.com/15110/getdatasheetpartid-40762-15110962.pdf?src-supplier=Verical; ComponentLink1Description: https://datasheet.ciiva.com/15110/getdatasheetpartid-40762-15110962.pdf?src-supplier=Verical; ComponentLink2URL: https://datasheet.ciiva.com/34301/764220-34301498.pdf?src-supplier=Jameco; ComponentLink2Description: https://datasheet.ciiva.com/34301/764220-34301498.pdf?src-supplier=Jameco; ComponentLink3URL: https://datasheet.ciiva.com/2041/ua78l05-2041782.pdf?src-supplier=Digi-Key; ComponentLink3Description: https://datasheet.ciiva.com/2041/ua78l05-2041782.pdf?src-supplier=Digi-Key; ComponentLink4URL: https://datasheet.ciiva.com/3224/ua78l15a-3224599.pdf?src-supplier=Avnet; ComponentLink4Description: https://datasheet.ciiva.com/3224/ua78l15a-3224599.pdf?src-supplier=Avnet; ComponentLink5URL: https://datasheet.ciiva.com/2041/ua78l05-2041784.pdf?src-supplier=Digi-Key; ComponentLink5Description: https://datasheet.ciiva.com/2041/ua78l05-2041784.pdf?src-supplier=Digi-Key; ComponentLink6URL: https://datasheet.ciiva.com/3224/ua78l15a-3224600.pdf?src-supplier=Avnet; ComponentLink6Description: https://datasheet.ciiva.com/3224/ua78l15a-3224600.pdf?src-supplier=Avnet; ComponentLink7URL: https://datasheet.ciiva.com/46429/1794486-46429899.pdf?src-supplier=Element14; ComponentLink7Description: https://datasheet.ciiva.com/46429/1794486-46429899.pdf?src-supplier=Element14; ComponentLink8URL: https://datasheet.ciiva.com/46429/1848990-46429886.pdf?src-supplier=Element14; ComponentLink8Description: https://datasheet.ciiva.com/46429/1848990-46429886.pdf?src-supplier=Element14; ComponentLink9URL: https://datasheet.ciiva.com/26167/ua78l12a-26167574.pdf?src-supplier=Avnet+Europe; ComponentLink9Description: https://datasheet.ciiva.com/26167/ua78l12a-26167574.pdf?src-supplier=Avnet+Europe; ComponentLink10URL: https://datasheet.ciiva.com/2041/ua78l05-2041783.pdf?src-supplier=Digi-Key; ComponentLink10Description: https://datasheet.ciiva.com/2041/ua78l05-2041783.pdf?src-supplier=Digi-Key; Supplier Part Number 1: 296-11118-1-ND
U2 = FT232RL-REEL: FTDI - FT232RL-REEL - Interface Bridges, USB to UART, 1.8 V, 5.25 V, SSOP, 28 Pins, -40 °C; Interface: UART,RS-232,RS-422,RS-485; Number of Channels: 1; Max Supply Voltage: 5.25V; Min Supply Voltage: 3.3V; Data Rate: 12Mbps; Operating Supply Current: 15mA; Voltage: 5V; Supplier 1: Digi-Key; Manufacturer: FTDI; Manufacturer Part Number: FT232RL-REEL; RoHS: Yes; Category: Interface ICs; Stock 1: 118934; Pricing 1: 1=4.50000, 10=4.05000, 50=3.85000, 100=3.65000, 250=3.25000, 500=2.85002, 1000=2.65000 (USD); Mount: Surface Mount; Case/Package: SSOP; Number of Pins: 28; Weight: 0.080001oz; Min Operating Temperature: -40°C; Max Operating Temperature: 85°C; Packaging: Tape and Reel; Package Quantity: 2000; Number of Transceivers: 1; Length: 10.2mm; Width: 5.3mm; Height: 1.75mm; Radiation Hardening: No; REACH SVHC: No SVHC; Lead Free: Lead Free; ComponentLink1URL: https://datasheet.ciiva.com/34304/2161019-34304054.pdf?src-supplier=Jameco; ComponentLink1Description: https://datasheet.ciiva.com/34304/2161019-34304054.pdf?src-supplier=Jameco; ComponentLink2URL: https://datasheet.ciiva.com/4787/ds-ft232r-11534-4787658.pdf?src-supplier=Mouser; ComponentLink2Description: https://datasheet.ciiva.com/4787/ds-ft232r-11534-4787658.pdf?src-supplier=Mouser; ComponentLink3URL: https://datasheet.ciiva.com/26841/ft232rl-reel-26841080.pdf?src-supplier=IIIC; ComponentLink3Description: https://datasheet.ciiva.com/26841/ft232rl-reel-26841080.pdf?src-supplier=IIIC; ComponentLink4URL: https://datasheet.ciiva.com/1787/ds-ft232r-1787047.pdf?src-supplier=Digi-Key; ComponentLink4Description: https://datasheet.ciiva.com/1787/ds-ft232r-1787047.pdf?src-supplier=Digi-Key; ComponentLink5URL: https://datasheet.ciiva.com/1787/ds-ft232r-1787048.pdf?src-supplier=Digi-Key; ComponentLink5Description: https://datasheet.ciiva.com/1787/ds-ft232r-1787048.pdf?src-supplier=Digi-Key; ComponentLink6URL: https://datasheet.ciiva.com/1787/ds-ft232r-1787049.pdf?src-supplier=Digi-Key; ComponentLink6Description: https://datasheet.ciiva.com/1787/ds-ft232r-1787049.pdf?src-supplier=Digi-Key; ComponentLink7URL: https://datasheet.ciiva.com/15150/getdatasheetpartid-643207-15150506.pdf?src-supplier=Verical; ComponentLink7Description: https://datasheet.ciiva.com/15150/getdatasheetpartid-643207-15150506.pdf?src-supplier=Verical; ComponentLink8URL: https://datasheet.ciiva.com/16200/ds-ft232r-16200652.pdf?src-supplier=Future+Electronics; ComponentLink8Description: https://datasheet.ciiva.com/16200/ds-ft232r-16200652.pdf?src-supplier=Future+Electronics; Supplier Part Number 1: 768-1007-1-ND